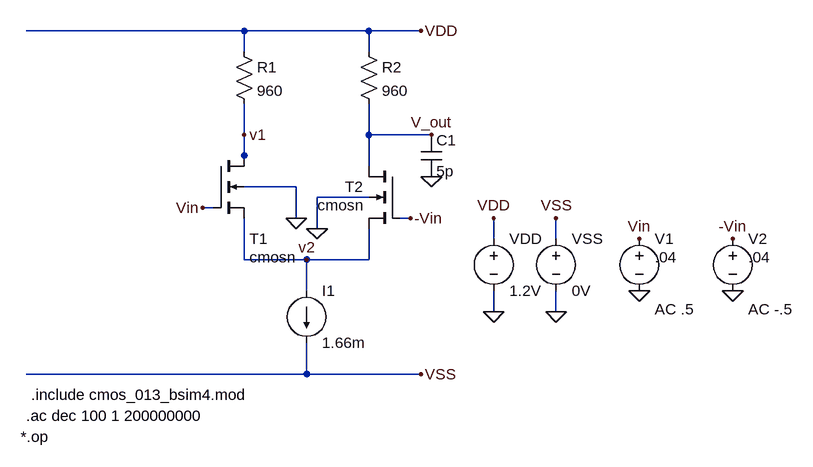
[diagram p0: schematic test2.asc]
test2.asc, the LTspice schematic file:
Version 4
SHEET 1 1452 680
WIRE 512 16 176 16
WIRE 704 16 512 16
WIRE 784 16 704 16
WIRE 512 48 512 16
WIRE 704 48 704 16
WIRE 512 176 512 128
WIRE 704 176 704 128
WIRE 800 176 704 176
WIRE 512 208 512 176
WIRE 512 224 512 208
WIRE 704 224 704 176
WIRE 592 256 512 256
WIRE 704 272 624 272
WIRE 464 288 448 288
WIRE 592 304 592 256
WIRE 768 304 752 304
WIRE 624 320 624 272
WIRE 896 336 896 304
WIRE 992 336 992 304
WIRE 512 368 512 304
WIRE 608 368 512 368
WIRE 704 368 704 320
WIRE 704 368 608 368
WIRE 608 416 608 368
WIRE 896 448 896 416
WIRE 992 448 992 416
WIRE 608 544 608 496
WIRE 608 544 176 544
WIRE 784 544 608 544
FLAG 784 16 VDD
FLAG 896 448 0
FLAG 896 304 VDD
FLAG 800 176 V_out
FLAG 784 544 VSS
FLAG 992 448 0
FLAG 992 304 VSS
FLAG 1120 416 0
FLAG 768 304 -Vin
FLAG 448 288 Vin
FLAG 1120 336 Vin
FLAG 1264 416 0
FLAG 1264 336 -Vin
FLAG 592 304 0
FLAG 624 320 0
FLAG 512 176 v1
FLAG 608 368 v2
FLAG 800 240 0
SYMBOL nmos4 752 224 M0
WINDOW 3 56 60 Left 2
SYMATTR Value cmosn
SYMATTR Value2 l=0.13u w=25u ad=8.125u as=8.125u pd=25.65u ps=25.65u
SYMATTR InstName T2
SYMBOL nmos4 464 208 R0
WINDOW 0 56 128 Left 2
WINDOW 3 56 156 Left 2
SYMATTR InstName T1
SYMATTR Value cmosn
SYMATTR Value2 l=0.13u w=25u ad=8.125u as=8.125u pd=25.65u ps=25.65u
SYMBOL voltage 896 320 R0
SYMATTR InstName VDD
SYMATTR Value 1.2V
SYMBOL voltage 992 320 R0
SYMATTR InstName VSS
SYMATTR Value 0V
SYMBOL voltage 1120 320 R0
WINDOW 123 24 124 Left 2
WINDOW 39 0 0 Left 0
WINDOW 3 24 44 Left 2
SYMATTR Value2 AC .5
SYMATTR Value .04
SYMATTR InstName V1
SYMBOL current 608 416 R0
WINDOW 123 0 0 Left 0
WINDOW 39 0 0 Left 0
SYMATTR InstName I1
SYMATTR Value 1.66m
SYMBOL voltage 1264 320 R0
WINDOW 123 24 124 Left 2
WINDOW 39 0 0 Left 0
WINDOW 3 24 44 Left 2
SYMATTR Value2 AC -.5
SYMATTR Value .04
SYMATTR InstName V2
SYMBOL cap 784 176 R0
SYMATTR InstName C1
SYMATTR Value 5p
SYMBOL res 496 32 R0
SYMATTR InstName R1
SYMATTR Value 960
SYMBOL res 688 32 R0
SYMATTR InstName R2
SYMATTR Value 960
TEXT 176 608 Left 2 !.ac dec 100 1 200000000
TEXT 184 576 Left 2 !.include cmos_013_bsim4.mod
TEXT 168 640 Left 2 !*.op

The netlist it stands for:
* test2.asc
M§T2 V_out -Vin v2 0 cmosn l=0.13u w=25u ad=8.125u as=8.125u pd=25.65u ps=25.65u
M§T1 v1 Vin v2 0 cmosn l=0.13u w=25u ad=8.125u as=8.125u pd=25.65u ps=25.65u
VDD VDD 0 1.2V
VSS VSS 0 0V
V1 Vin 0 .04 AC .5
I1 v2 VSS 1.66m
V2 -Vin 0 .04 AC -.5
C1 V_out 0 5p
R1 VDD v1 960
R2 VDD V_out 960
.model NMOS NMOS
.model PMOS PMOS
.lib standard.mos
.ac dec 100 1 200000000
.include cmos_013_bsim4.mod
*.op
.backanno
.end